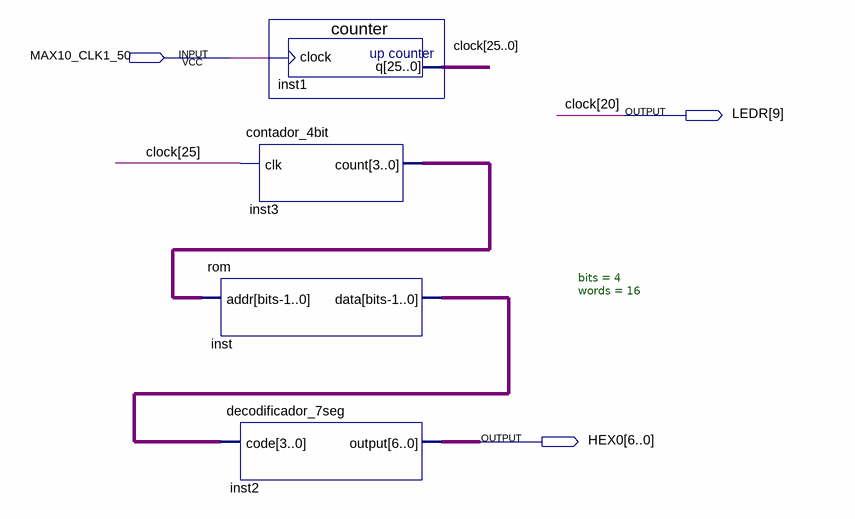
[diagram p0: schematic sheet]
// Quartus schematic Block1.bdf as structural Verilog: 4 symbols, 3 pins
module Block1 (
  input  MAX10_CLK1_50,
  output [9:9] LEDR,
  output [6:0] HEX0
);

  wire [3:0] inst3_count, inst_data;
  wire [25:0] clock;

  contador_4bit inst3 (.clk(clock[25]), .count(inst3_count));
  rom #(.bits(4), .words(16)) inst (.addr(inst3_count), .data(inst_data));
  decodificador_7seg inst2 (.code(inst_data), .\output (HEX0));
  counter inst1 (.clock(MAX10_CLK1_50), .q({clock[25:21], LEDR[9], clock[19:0]}));

  // Other names for the same wires on the sheet: clock[20] = LEDR[9]
endmodule
